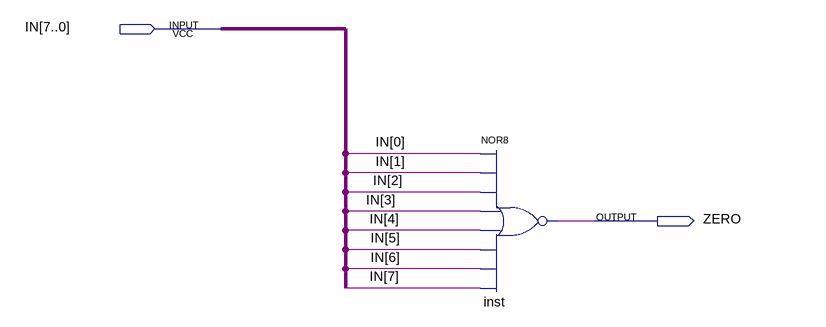
[diagram p0: schematic sheet]
// Quartus schematic check_zero.bdf as structural Verilog: 1 symbols, 2 pins
module check_zero (
  input  [7:0] IN,
  output ZERO
);

  nor inst (ZERO, IN[0], IN[1], IN[2], IN[3], IN[4], IN[5], IN[6], IN[7]);
endmodule
